# Altium schematic sheet ArbPwrBoost_P7.SchDoc: =ProjectTitle
size B; Engineer: Hab Collector; Organization: Altium Limited; Address1: 3621 Gin Way; Address2: Snellville, GA 30039; SheetNumber: 7; SheetTotal: 8
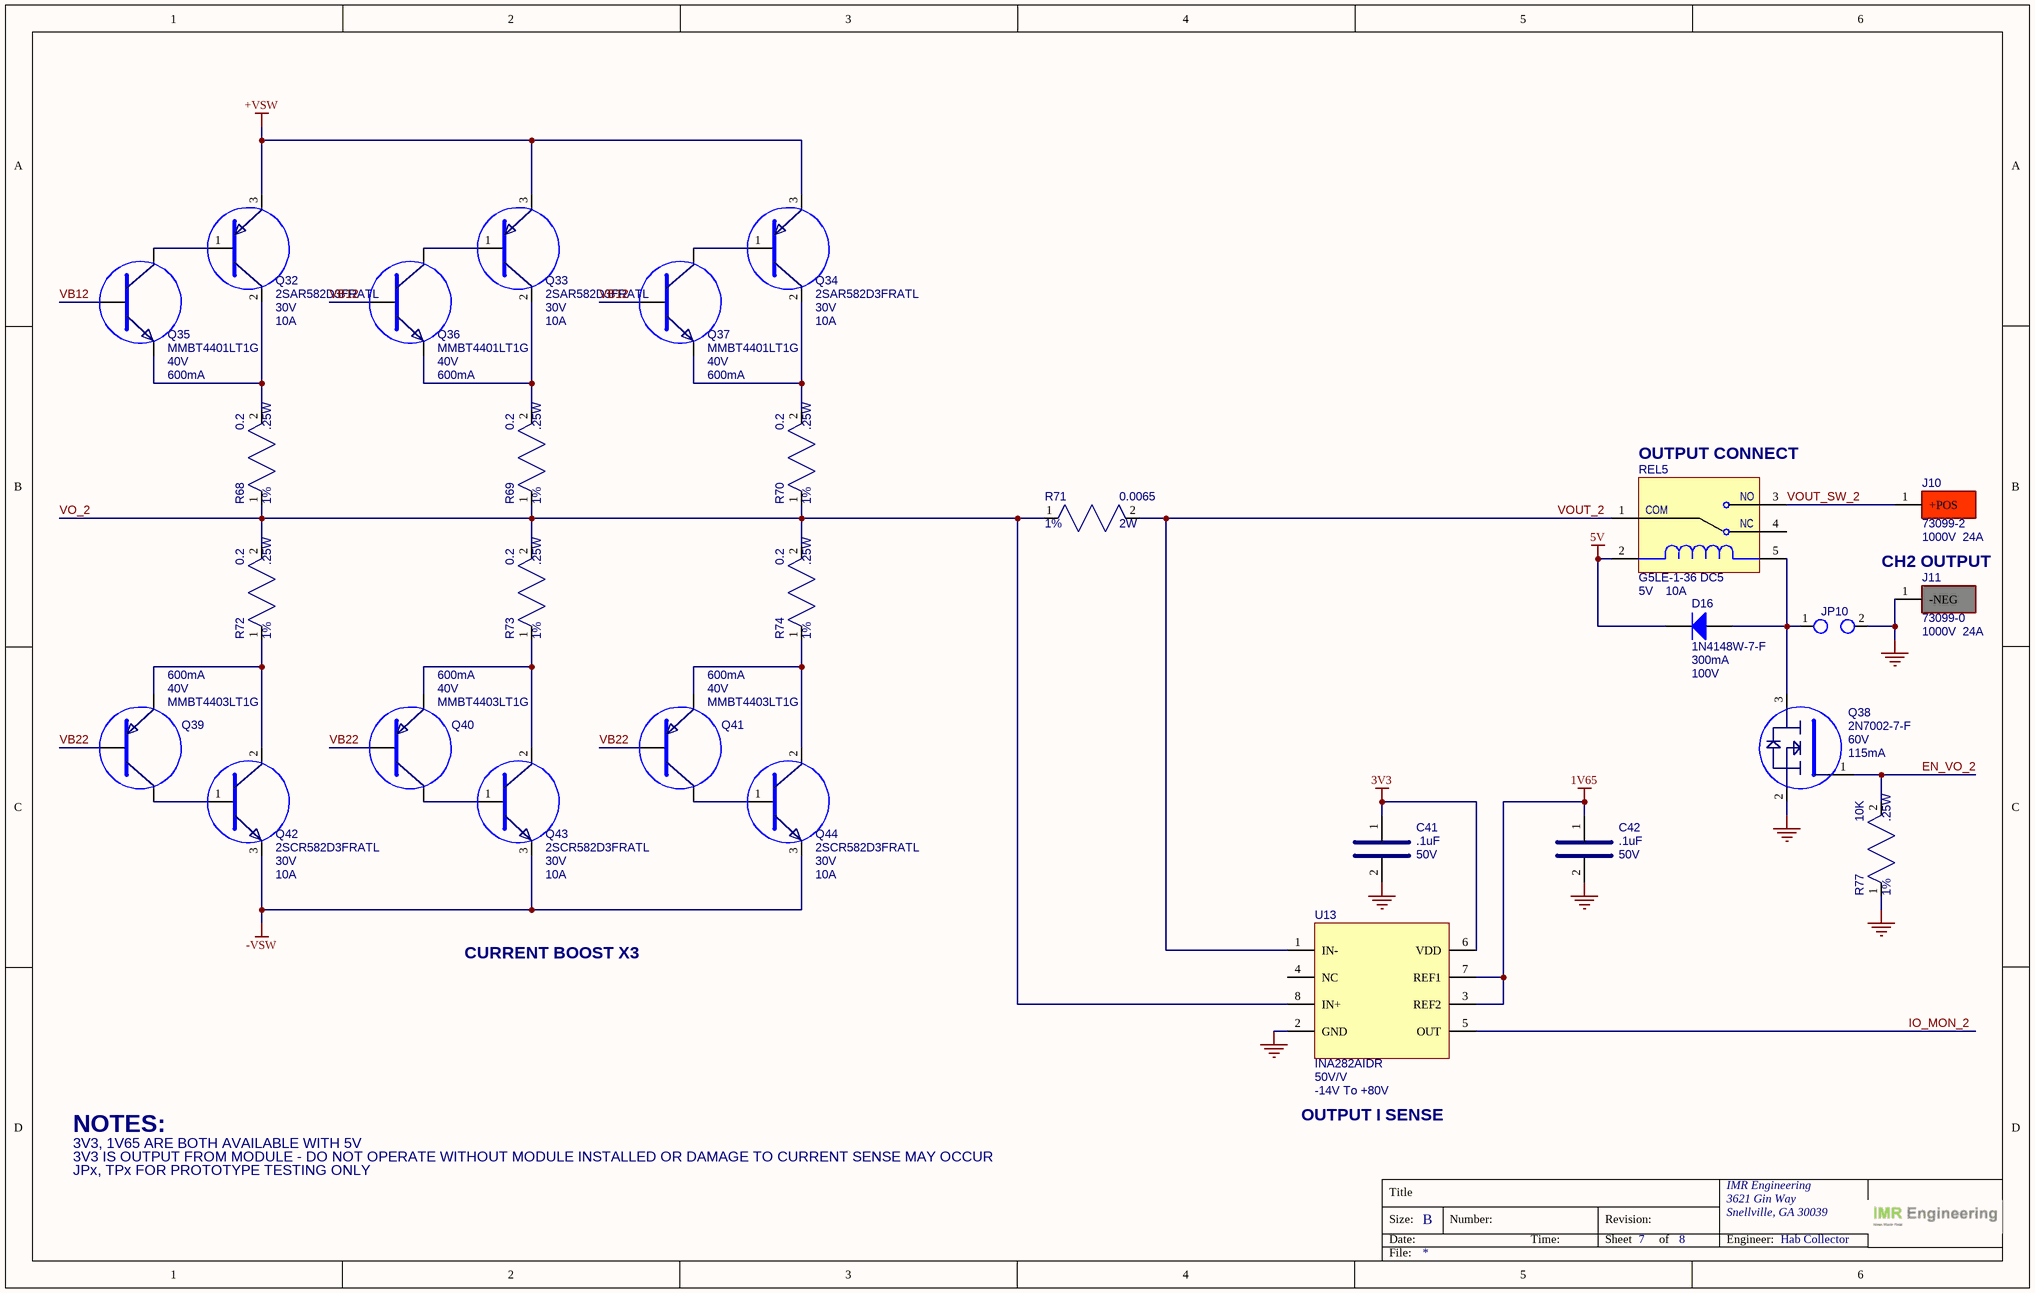
[diagram p0: ArbPwrBoost_P7.SchDoc]

## Parts
C41  value .1uF  Voltage: 50V  [CAP_0805]  (hidden comment: KGM21NR71H104KT)
C42  value .1uF  Voltage: 50V  [CAP_0805]  (hidden comment: KGM21NR71H104KT)
D16  value 100V  Current: 300mA  [SOD123]  (hidden comment: 1N4148W-7-F)
J10  value 1000V  Current: 24A  [Pomona_73099-2]  (hidden comment: 73099-2)
J11  value 1000V  Current: 24A  [Pomona_73099-0]  (hidden comment: 73099-0)
JP10  PREC002SFAN-RC  [HDR_1X2_100MILL]  (value not drawn)
Q32  value 30V  Current: 10A  [TO-252]  (hidden comment: 2SAR582D3FRATL)
Q33  value 30V  Current: 10A  [TO-252]  (hidden comment: 2SAR582D3FRATL)
Q34  value 30V  Current: 10A  [TO-252]  (hidden comment: 2SAR582D3FRATL)
Q35  value 40V  Current: 600mA  [SOT-23]  (hidden comment: MMBT4401LT1G)
Q36  value 40V  Current: 600mA  [SOT-23]  (hidden comment: MMBT4401LT1G)
Q37  value 40V  Current: 600mA  [SOT-23]  (hidden comment: MMBT4401LT1G)
Q38  value 60V  Current: 115mA  [SOT-23]  (hidden comment: 2N7002-7-F)
Q39  value 40V  Current: 600mA  [SOT-23]  (hidden comment: MMBT4403LT1G)
Q40  value 40V  Current: 600mA  [SOT-23]  (hidden comment: MMBT4403LT1G)
Q41  value 40V  Current: 600mA  [SOT-23]  (hidden comment: MMBT4403LT1G)
Q42  value 30V  Current: 10A  [TO-252]  (hidden comment: 2SCR582D3FRATL)
Q43  value 30V  Current: 10A  [TO-252]  (hidden comment: 2SCR582D3FRATL)
Q44  value 30V  Current: 10A  [TO-252]  (hidden comment: 2SCR582D3FRATL)
R68  value 0.2  Power: .25W  Tolerance: 1%  [RES_1206]  (hidden comment: RL1206FR-070R2L)
R69  value 0.2  Power: .25W  Tolerance: 1%  [RES_1206]  (hidden comment: RL1206FR-070R2L)
R70  value 0.2  Power: .25W  Tolerance: 1%  [RES_1206]  (hidden comment: RL1206FR-070R2L)
R71  value 0.0065  Tolerance: 1%  Power: 2W  [RES_2512]  (hidden comment: WSL25126L500FEA18)
R72  value 0.2  Power: .25W  Tolerance: 1%  [RES_1206]  (hidden comment: RL1206FR-070R2L)
R73  value 0.2  Power: .25W  Tolerance: 1%  [RES_1206]  (hidden comment: RL1206FR-070R2L)
R74  value 0.2  Power: .25W  Tolerance: 1%  [RES_1206]  (hidden comment: RL1206FR-070R2L)
R77  value 10K  Power: .25W  Tolerance: 1%  [RES_0805]  (hidden comment: RC0805FR-7W10KL)
REL5  value 5V  Current: 10A  [G5LE]  (hidden comment: G5LE-1-36 DC5)
U13  value 50V/V  Common Mode: -14V To +80V  [SOIC-8_54]  (hidden comment: INA282AIDR)

## Nets
1V65: C42.1 U13.3(REF2) U13.7(REF1)
3V3: C41.1 U13.6(VDD)
5V: D16.2(K) REL5.2
+VSW: Q32.3(E) Q33.3(E) Q34.3(E)
-VSW: Q42.3(E) Q43.3(E) Q44.3(E)
GND: C41.2 C42.2 J11.1(-NEG) JP10.2 Q38.2(E) R77.1 U13.2(GND)
EN_VO_2: Q38.1(B) R77.2
IO_MON_2: U13.5(OUT)
VB12: Q35.1(B) Q36.1(B) Q37.1(B)
VB22: Q39.1(B) Q40.1(B) Q41.1(B)
VO_2: R68.1 R69.1 R70.1 R71.1 R72.2 R73.2 R74.2 U13.8(IN+)
VOUT_2: R71.2 REL5.1(COM) U13.1(IN-)
VOUT_SW_2: J10.1(+POS) REL5.3(NO)
NetD16_1: D16.1(A) JP10.1 Q38.3(C) REL5.5
NetQ32_1: Q32.1(B) Q35.3(C)
NetQ32_2: Q32.2(C) Q35.2(E) R68.2
NetQ33_1: Q33.1(B) Q36.3(C)
NetQ33_2: Q33.2(C) Q36.2(E) R69.2
NetQ34_1: Q34.1(B) Q37.3(C)
NetQ34_2: Q34.2(C) Q37.2(E) R70.2
NetQ39_2: Q39.2(E) Q42.2(C) R72.1
NetQ39_3: Q39.3(C) Q42.1(B)
NetQ40_2: Q40.2(E) Q43.2(C) R73.1
NetQ40_3: Q40.3(C) Q43.1(B)
NetQ41_2: Q41.2(E) Q44.2(C) R74.1
NetQ41_3: Q41.3(C) Q44.1(B)

Not connected (* = marked no-connect by the designer): REL5 4(NC); U13 4(NC)

## Notes on the sheet
- (near REL5) OUTPUT CONNECT
- (near J11) CH2 OUTPUT
- CURRENT BOOST X3
- NOTES:
- 3V3, 1V65 ARE BOTH AVAILABLE WITH 5V
- 3V3 IS OUTPUT FROM MODULE - DO NOT OPERATE WITHOUT MODULE INSTALLED OR DAMAGE TO CURRENT SENSE MAY OCCUR
- JPx, TPx FOR PROTOTYPE TESTING ONLY
- OUTPUT I SENSE
- Title
- Size:
- Date:
- B
- Number:
- Time:
- Revision:
- Sheet
- of
- IMR Engineering
- Engineer:
- File:

## Library data of the parts
C41 C42 = CAP_SMD_0.1UF_50V_0805: CAP CER 0.1UF 50V X7R 0805; MFG: KYOCERA AVX; Case/Package: 0805; MFG_PN: KGM21NR71H104KT; Supplier 1: DigiKey; Supplier Part Number 1: 478-KGM21NR71H104KTCT-ND; Unit Price: .1
D16 = DIODE_1N4148W-7-F: RELAY REED SPDT 250MA 5V; MFG: Diodes Inc; Case/Package: SOD-123; Supplier 1: DigiKey; Supplier Part Number 1: 1N4148W-FDICT-ND; Unit Price: .16; MFG_PN: 1N4148W-7-F
J10 = CONN_PANOMA_73099-2: CONN 4mm Banana Socket Right Angle PCB RED; MFG: Pomona; Case/Package: 73099-2; Supplier 1: DigiKey; Supplier Part Number 1: 501-73099-2-ND; Unit Price: 10.39; MFG_PN: 73099-2
J11 = CONN_PANOMA_73099-0: CONN 4mm Banana Socket Right Angle PCB BLK; MFG: Pomona; Case/Package: 73099-0; Supplier 1: DigiKey; Supplier Part Number 1: 501-73099-0-ND; Unit Price: 10.39; MFG_PN: 73099-0
JP10 = CONN_JUMPER_2P_100MIL_VERT: CONN HEADER VERT 2POS 2.54MM; MFG: Sullins Connector Solutions; Case/Package: 2P_2.54MM; MFG_PN: PREC002SFAN-RC; Supplier 1: Digi-Key; Supplier Part Number 1: S1212EC-02-ND; Value: *; Unit Price: .07
Q32-Q34 = BJT_PNP_2SAR582D3FRATL: TRANS PNP 30V 5.7A TO-252; MFG: Rohm Semiconductor; Case/Package: TO-252; Supplier 1: DigiKey; Supplier Part Number 1: 846-2SAR582D3FRATLCT-ND; Unit Price: 1.59; MFG_PN: 2SAR582D3FRATL
Q35-Q37 = BJT_NPN_MMBT4401LT1G: TRANS NPN 40V 0.6A SOT23-3; MFG: On Semiconductor; Case/Package: SOT-23; Supplier 1: DigiKey; Supplier Part Number 1: MMBT4401LT1GOSCT-ND; Unit Price: .13; MFG_PN: MMBT4401LT1G
Q38 = MOSFET_NCH_2N7002-7-F: MOSFET N-CH 60V 115MA SOT23-3; MFG: Diodes Inc; Case/Package: SOT-23; Supplier 1: DigiKey; Supplier Part Number 1: 2N7002-FDICT-ND; Unit Price: .20; MFG_PN: 2N7002-7-F
Q39-Q41 = BJT_PNP_MMBT4403LT1G: TRANS PNP 40V 0.6A SOT23-3; MFG: On Semiconductor; Case/Package: SOT-23; Supplier 1: DigiKey; Supplier Part Number 1: MMBT4403LT1GOSCT-ND; Unit Price: .13; MFG_PN: MMBT4403LT1G
Q42-Q44 = BJT_NPN_2SCR582D3FRATL: TRANS NPN 30V 10A TO-252; MFG: Rohm Semiconductor; Case/Package: TO-252; Supplier 1: DigiKey; Supplier Part Number 1: 846-2SCR582D3FRATLCT-ND; Unit Price: 1.76; MFG_PN: 2SCR582D3FRATL
R68-R70 R72-R74 = RES_SMD_0.2_1206_1/4W_1%: RES SMD 0.2 OHM 1% 1/4W 1206; MFG: Yageo; Case/Package: 1206; MFG_PN: RL1206FR-070R2L; Supplier 1: DigiKey; Supplier Part Number 1: 311-0.2LWCT-ND; Unit Price: .27
R71 = RES_SMD_0.0065_2512_2W_1%: RES SMD 0.0065 OHM 1% 2W 2512; MFG: Vishay Dale; Case/Package: 2512; MFG_PN: WSL25126L500FEA18; Supplier 1: DigiKey; Supplier Part Number 1: 541-WSL25126L500FEA18CT-ND; Unit Price: 1.76
R77 = RES_SMD_10K_0805_1/4W_1%: RES SMD 10K OHM 1% 1/4W 0805; MFG: Yageo; Case/Package: 0805; MFG_PN: RC0805FR-7W10KL; Supplier 1: DigiKey; Supplier Part Number 1: 13-RC0805FR-7W10KLCT-ND; Unit Price: .10
REL5 = RELAY_G5LE-1-36 DC5: RELAY GEN PURPOSE SPDT 10A 5V; MFG: Omron; Case/Package: G5LE; Supplier 1: DigiKey; Supplier Part Number 1: G5LE-1-36DC5-ND; Unit Price: 1.24; Supplier: DigiKey; Manufacturer: Omron; MFG_PN: G5LE-1-36 DC5
U13 = IC_INA282AIDR: IC CURRENT SENSE 0.4% 50V/V SOIC-8; MFG: Texas Instruments; Case/Package: SOIC-8; Supplier 1: DigiKey; Supplier Part Number 1: 296-27820-1-ND; Unit Price: 4.13; MFG_PN: INA282AIDR